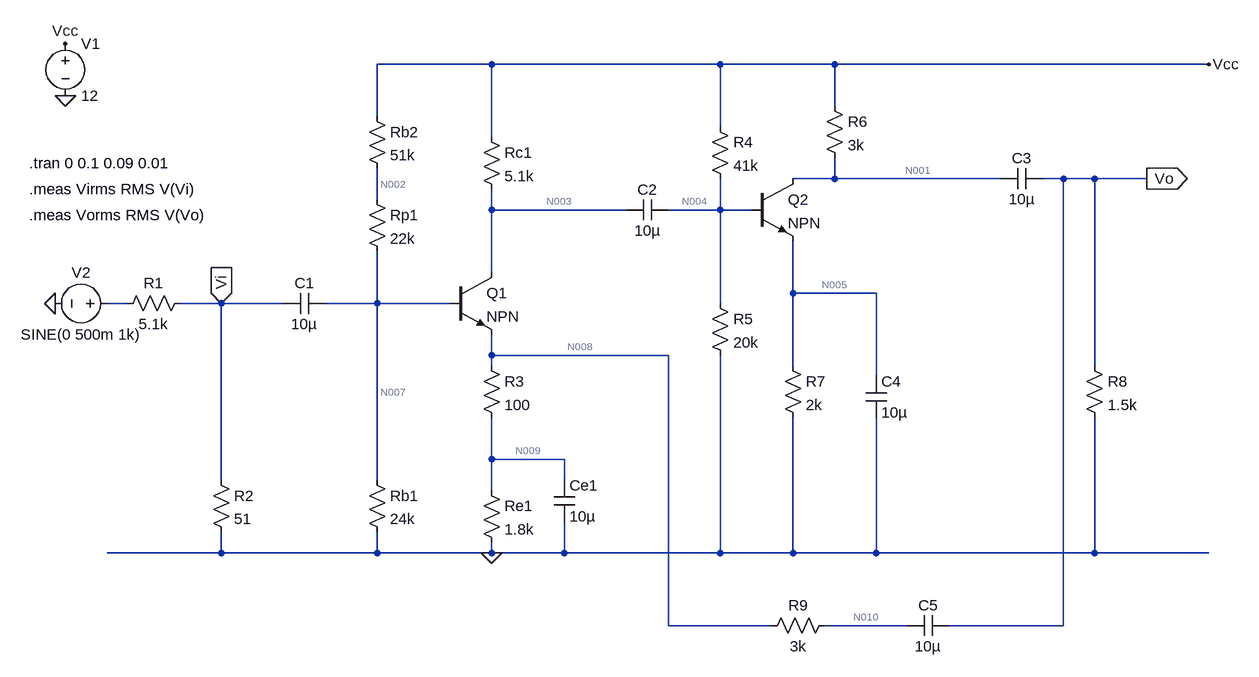
[diagram p0: schematic Experiment3_2_1.asc]
Experiment3_2_1.asc, the LTspice schematic file:
Version 4.1
SHEET 1 920 680
WIRE -240 -272 -416 -272
WIRE 112 -272 -240 -272
WIRE 288 -272 112 -272
WIRE 864 -272 288 -272
WIRE 288 -208 288 -272
WIRE -416 -192 -416 -272
WIRE 112 -176 112 -272
WIRE -240 -160 -240 -272
WIRE 288 -96 288 -128
WIRE 288 -96 224 -96
WIRE 544 -96 288 -96
WIRE 640 -96 608 -96
WIRE 688 -96 640 -96
WIRE 768 -96 688 -96
WIRE -416 -64 -416 -112
WIRE -240 -48 -240 -80
WIRE -32 -48 -240 -48
WIRE 112 -48 112 -96
WIRE 112 -48 32 -48
WIRE 160 -48 112 -48
WIRE -240 48 -240 -48
WIRE 224 80 224 0
WIRE 352 80 224 80
WIRE -800 96 -832 96
WIRE -656 96 -720 96
WIRE -560 96 -656 96
WIRE -416 96 -416 16
WIRE -416 96 -496 96
WIRE -304 96 -416 96
WIRE 112 96 112 -48
WIRE -240 176 -240 144
WIRE 32 176 -240 176
WIRE -240 192 -240 176
WIRE 224 192 224 80
WIRE 688 192 688 -96
WIRE 352 208 352 80
WIRE -240 336 -240 272
WIRE -128 336 -240 336
WIRE -656 368 -656 96
WIRE -416 368 -416 96
WIRE -128 368 -128 336
WIRE -240 384 -240 336
WIRE -656 480 -656 448
WIRE -656 480 -832 480
WIRE -416 480 -416 448
WIRE -416 480 -656 480
WIRE -240 480 -240 464
WIRE -240 480 -416 480
WIRE -128 480 -128 432
WIRE -128 480 -240 480
WIRE 112 480 112 176
WIRE 112 480 -128 480
WIRE 224 480 224 272
WIRE 224 480 112 480
WIRE 352 480 352 272
WIRE 352 480 224 480
WIRE 688 480 688 272
WIRE 688 480 352 480
WIRE 864 480 688 480
WIRE 32 592 32 176
WIRE 192 592 32 592
WIRE 400 592 272 592
WIRE 640 592 640 -96
WIRE 640 592 464 592
FLAG -240 480 0
FLAG 864 -272 Vcc
FLAG -896 -304 Vcc
FLAG -896 -224 0
FLAG -912 96 0
FLAG 768 -96 Vo
IOPIN 768 -96 Out
FLAG -656 96 Vi
IOPIN -656 96 In
SYMBOL res -704 80 R90
WINDOW 0 0 56 VBottom 2
WINDOW 3 32 56 VTop 2
SYMATTR InstName R1
SYMATTR Value 5.1k
SYMBOL res -672 352 R0
SYMATTR InstName R2
SYMATTR Value 51
SYMBOL res -432 352 R0
SYMATTR InstName Rb1
SYMATTR Value 24k
SYMBOL res -432 -80 R0
SYMATTR InstName Rp1
SYMATTR Value 22k
SYMBOL res -432 -208 R0
SYMATTR InstName Rb2
SYMATTR Value 51k
SYMBOL npn -304 48 R0
SYMATTR InstName Q1
SYMBOL res -256 368 R0
SYMATTR InstName Re1
SYMATTR Value 1.8k
SYMBOL res -256 -176 R0
SYMATTR InstName Rc1
SYMATTR Value 5.1k
SYMBOL voltage -896 -320 R0
WINDOW 123 0 0 Left 0
WINDOW 39 0 0 Left 0
SYMATTR InstName V1
SYMATTR Value 12
SYMBOL cap -496 80 R90
WINDOW 0 0 32 VBottom 2
WINDOW 3 32 32 VTop 2
SYMATTR InstName C1
SYMATTR Value 10µ
SYMATTR SpiceLine V=6.3 Irms=0 Rser=4 Lser=0 mfg="AVX" pn="TAJA106M006" type="Tantalum"
SYMBOL cap -32 -32 R270
WINDOW 0 32 32 VTop 2
WINDOW 3 0 32 VBottom 2
SYMATTR InstName C2
SYMATTR Value 10µ
SYMATTR SpiceLine V=6.3 Irms=0 Rser=4 Lser=0 mfg="AVX" pn="TAJA106M006" type="Tantalum"
SYMBOL cap -144 368 R0
SYMATTR Value 10µ
SYMATTR InstName Ce1
SYMATTR SpiceLine V=6.3 Irms=0 Rser=4 Lser=0 mfg="AVX" pn="TAJA106M006" type="Tantalum"
SYMBOL voltage -816 96 R90
WINDOW 0 -32 56 VBottom 2
WINDOW 3 32 56 VTop 2
WINDOW 123 0 0 Left 0
WINDOW 39 0 0 Left 0
SYMATTR InstName V2
SYMATTR Value SINE(0 500m 1k)
SYMBOL res -256 176 R0
SYMATTR InstName R3
SYMATTR Value 100
SYMBOL res 96 -192 R0
SYMATTR InstName R4
SYMATTR Value 41k
SYMBOL res 96 80 R0
SYMATTR InstName R5
SYMATTR Value 20k
SYMBOL npn 160 -96 R0
SYMATTR InstName Q2
SYMBOL res 272 -224 R0
SYMATTR InstName R6
SYMATTR Value 3k
SYMBOL cap 544 -80 R270
WINDOW 0 32 32 VTop 2
WINDOW 3 0 32 VBottom 2
SYMATTR InstName C3
SYMATTR Value 10µ
SYMATTR SpiceLine V=6.3 Irms=0 Rser=4 Lser=0 mfg="AVX" pn="TAJA106M006" type="Tantalum"
SYMBOL res 208 176 R0
SYMATTR InstName R7
SYMATTR Value 2k
SYMBOL cap 336 208 R0
SYMATTR InstName C4
SYMATTR Value 10µ
SYMATTR SpiceLine V=6.3 Irms=0 Rser=4 Lser=0 mfg="AVX" pn="TAJA106M006" type="Tantalum"
SYMBOL res 672 176 R0
SYMATTR InstName R8
SYMATTR Value 1.5k
SYMBOL res 288 576 R90
WINDOW 0 0 56 VBottom 2
WINDOW 3 32 56 VTop 2
SYMATTR InstName R9
SYMATTR Value 3k
SYMBOL cap 400 608 R270
WINDOW 0 32 32 VTop 2
WINDOW 3 0 32 VBottom 2
SYMATTR InstName C5
SYMATTR Value 10µ
SYMATTR SpiceLine V=6.3 Irms=0 Rser=4 Lser=0 mfg="AVX" pn="TAJA106M006" type="Tantalum"
TEXT -952 -120 Left 2 !.tran 0 0.1 0.09 0.01
TEXT -952 -80 Left 2 !.meas Virms RMS V(Vi)
TEXT -952 -40 Left 2 !.meas Vorms RMS V(Vo)

The netlist it stands for:
* Experiment3_2_1.asc
R1 Vi N006 5.1k
R2 Vi 0 51
Rb1 N007 0 24k
Rp1 N002 N007 22k
Rb2 Vcc N002 51k
Q1 N003 N007 N008 0 NPN
Re1 N009 0 1.8k
Rc1 Vcc N003 5.1k
V1 Vcc 0 12
C1 N007 Vi 10µ V=6.3 Irms=0 Rser=4 Lser=0 mfg="AVX" pn="TAJA106M006" type="Tantalum"
C2 N003 N004 10µ V=6.3 Irms=0 Rser=4 Lser=0 mfg="AVX" pn="TAJA106M006" type="Tantalum"
Ce1 N009 0 10µ V=6.3 Irms=0 Rser=4 Lser=0 mfg="AVX" pn="TAJA106M006" type="Tantalum"
V2 N006 0 SINE(0 500m 1k)
R3 N008 N009 100
R4 Vcc N004 41k
R5 N004 0 20k
Q2 N001 N004 N005 0 NPN
R6 Vcc N001 3k
C3 N001 Vo 10µ V=6.3 Irms=0 Rser=4 Lser=0 mfg="AVX" pn="TAJA106M006" type="Tantalum"
R7 N005 0 2k
C4 N005 0 10µ V=6.3 Irms=0 Rser=4 Lser=0 mfg="AVX" pn="TAJA106M006" type="Tantalum"
R8 Vo 0 1.5k
R9 N010 N008 3k
C5 N010 Vo 10µ V=6.3 Irms=0 Rser=4 Lser=0 mfg="AVX" pn="TAJA106M006" type="Tantalum"
.model NPN NPN
.model PNP PNP
.lib standard.bjt
.tran 0 0.1 0.09 0.01
.meas Virms RMS V(Vi)
.meas Vorms RMS V(Vo)
.backanno
.end

* Results of the author's LTspice run, read from the files saved beside the schematic
* Operating Point, zero values left out:
*   V(n002) = 5.559 V
*   V(vcc) = 12 V
*   V(n008) = 2.005 V
*   V(n001) = 7.613 V
*   V(n010) = 2.005 V
*   V(n007) = 2.78 V
*   V(n003) = 6.671 V
*   V(n009) = 1.899 V
*   V(n004) = 3.738 V
*   V(n005) = 2.954 V
*   Ic(Q1) = 1.045 mA
*   Ib(Q1) = 10.45 µA
*   Ie(Q1) = -1.055 mA
*   I(R3) = 1.055 mA
*   I(R5) = 186.9 µA
*   I(Rb1) = 115.8 µA
*   I(Rb2) = 126.3 µA
*   I(Rc1) = 1.045 mA
*   I(Rp1) = 126.3 µA
*   I(Re1) = 1.055 mA
*   I(V1) = -2.835 mA
*   I(R4) = 201.5 µA
*   Ic(Q2) = 1.462 mA
*   Ib(Q2) = 14.62 µA
*   Ie(Q2) = -1.477 mA
*   I(R6) = 1.462 mA
*   I(R7) = 1.477 mA
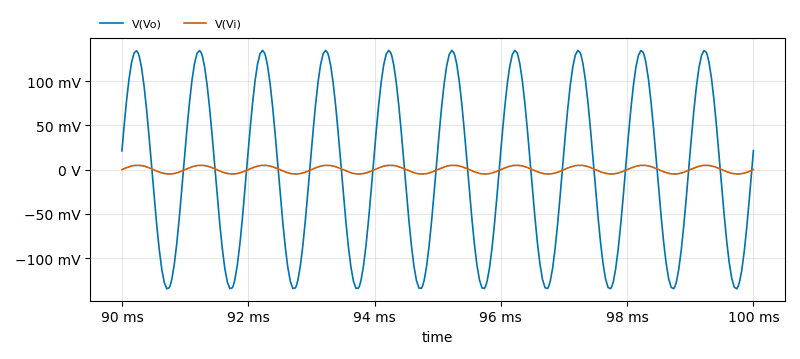
[diagram p1: Transient Analysis of Experiment3_2_1.asc, plotted from the saved traces]
* Transient Analysis, 1 run:
*   V(Vo): min -134.6 mV, max 134.8 mV, average -34.24 µV, rms 95.41 mV, last 21.51 mV
*   V(Vi): min -4.935 mV, max 4.935 mV, average 119 nV, rms 3.492 mV, last 167.8 nV
* From the log:
*   virms: RMS(V(Vi))=0.0034740759369 FROM 0 TO 0.01
*   vorms: RMS(V(Vo))=0.0949231835519 FROM 0 TO 0.01